# EasyEDA Pro project OURs_PHONE_EPRO_FILE_2025-04-21.epro, board 1-PCB_PCB_OURS PHONE_CONNECTORS_FLIP
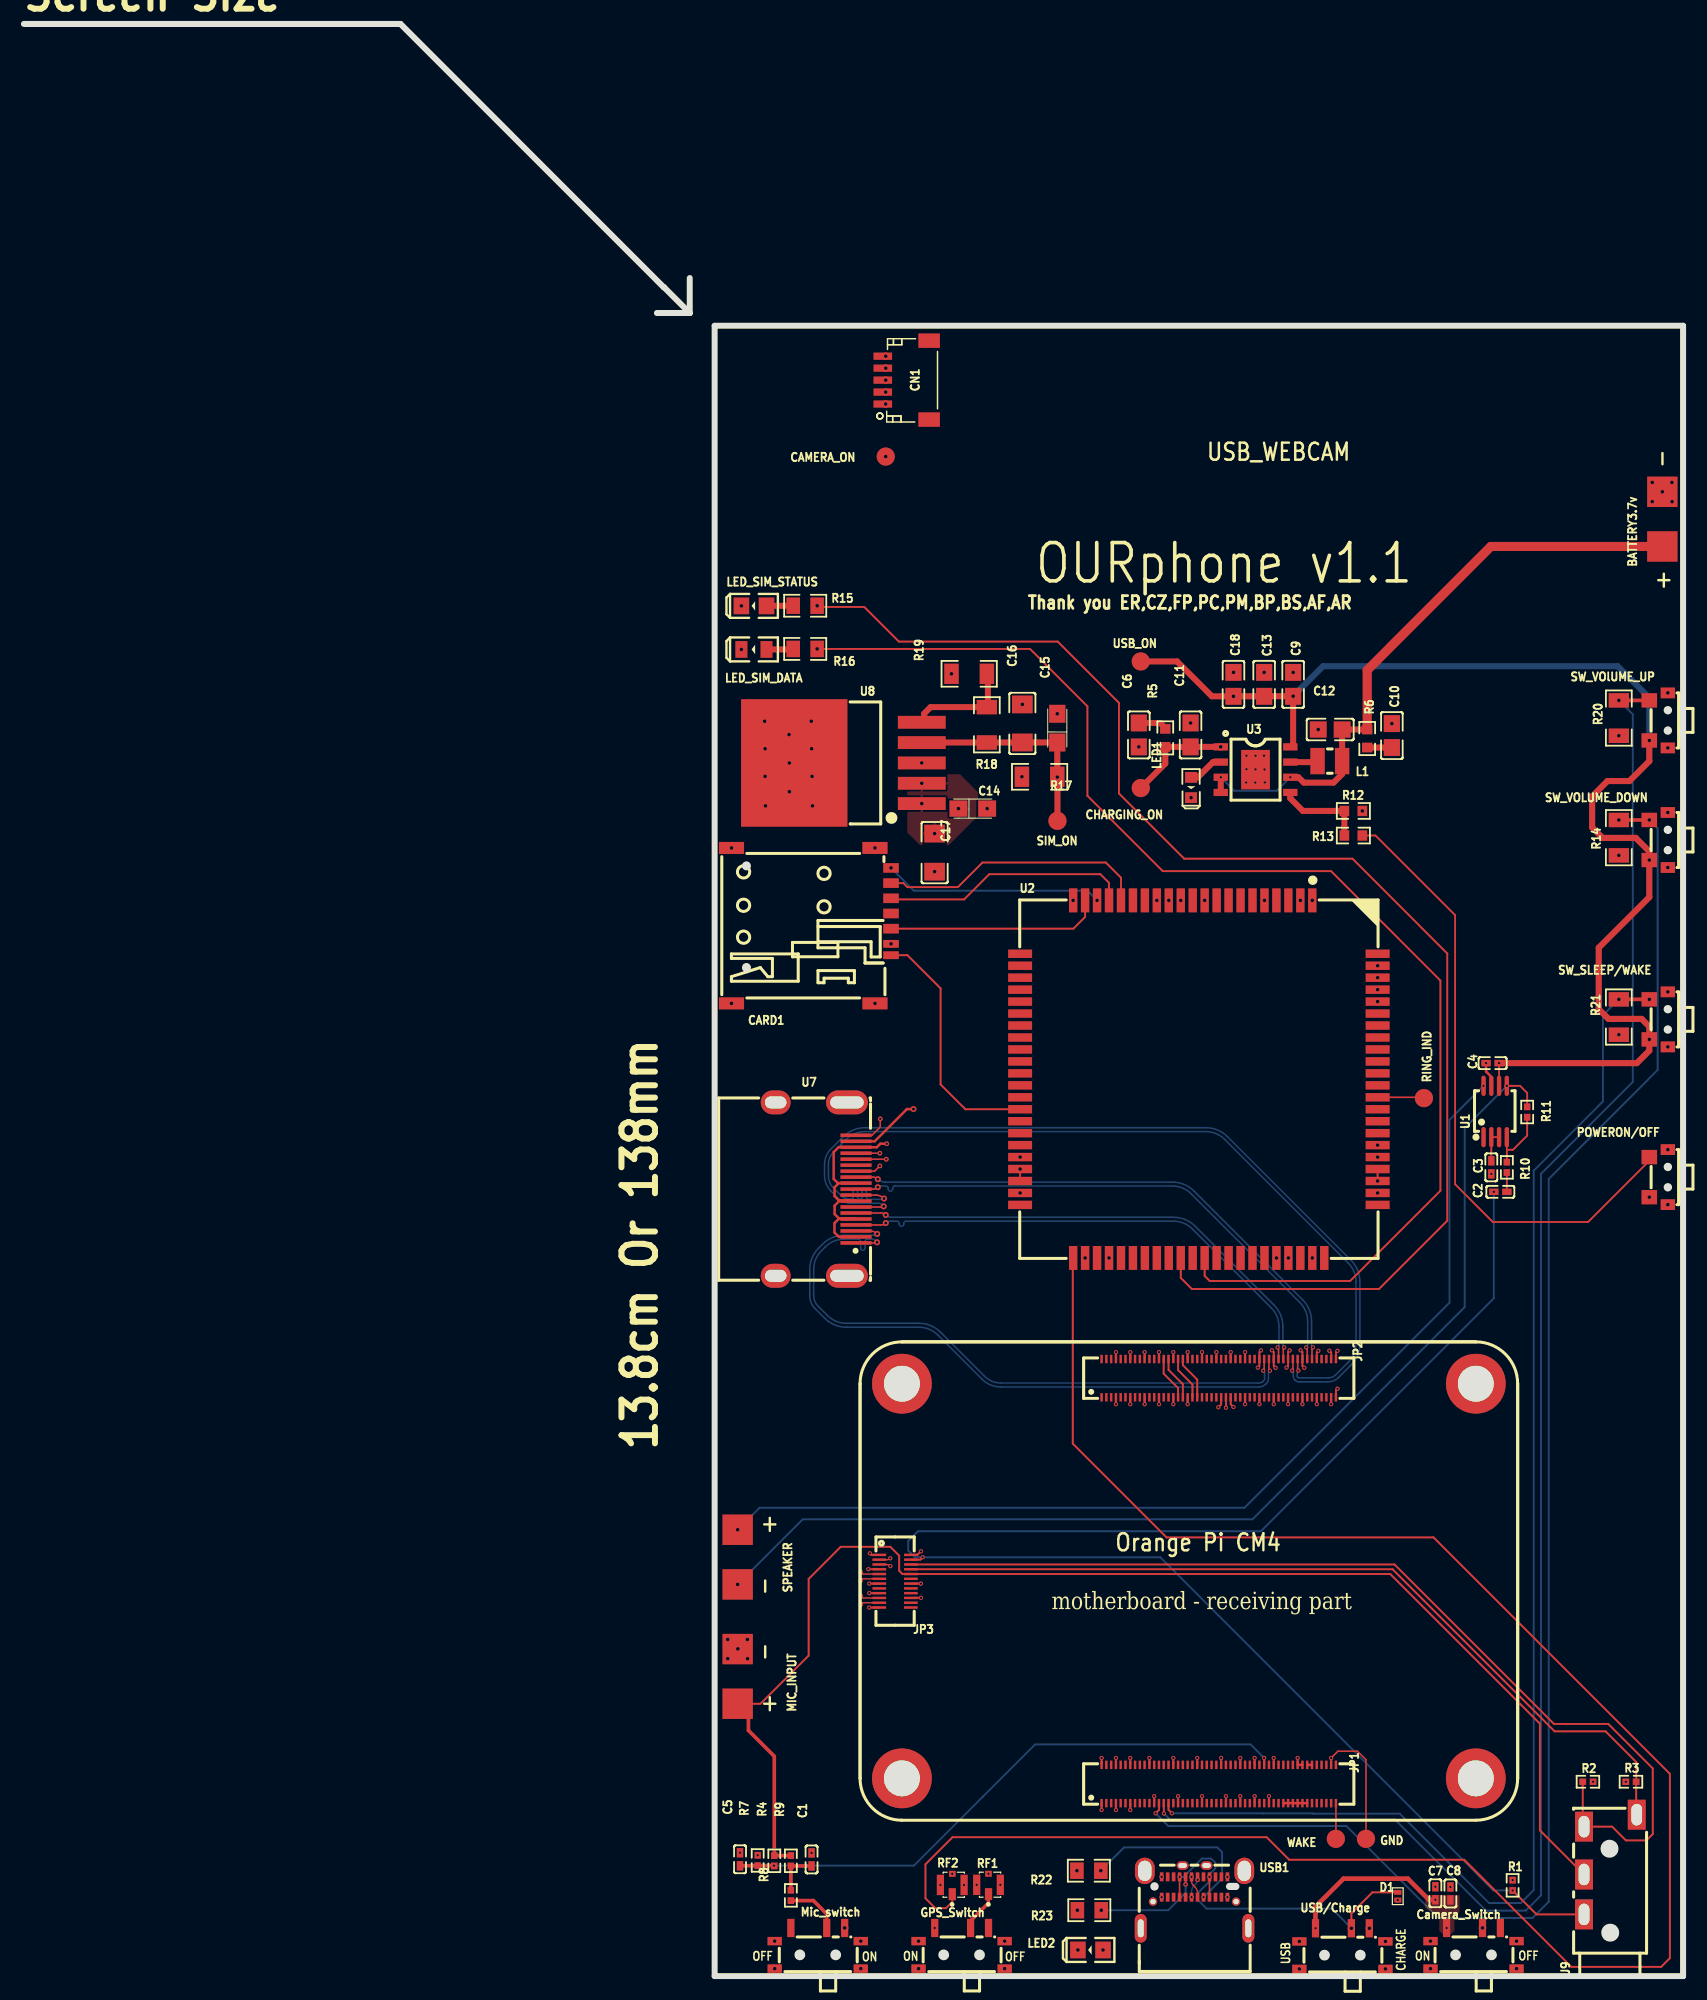
[diagram p10: board, top side]
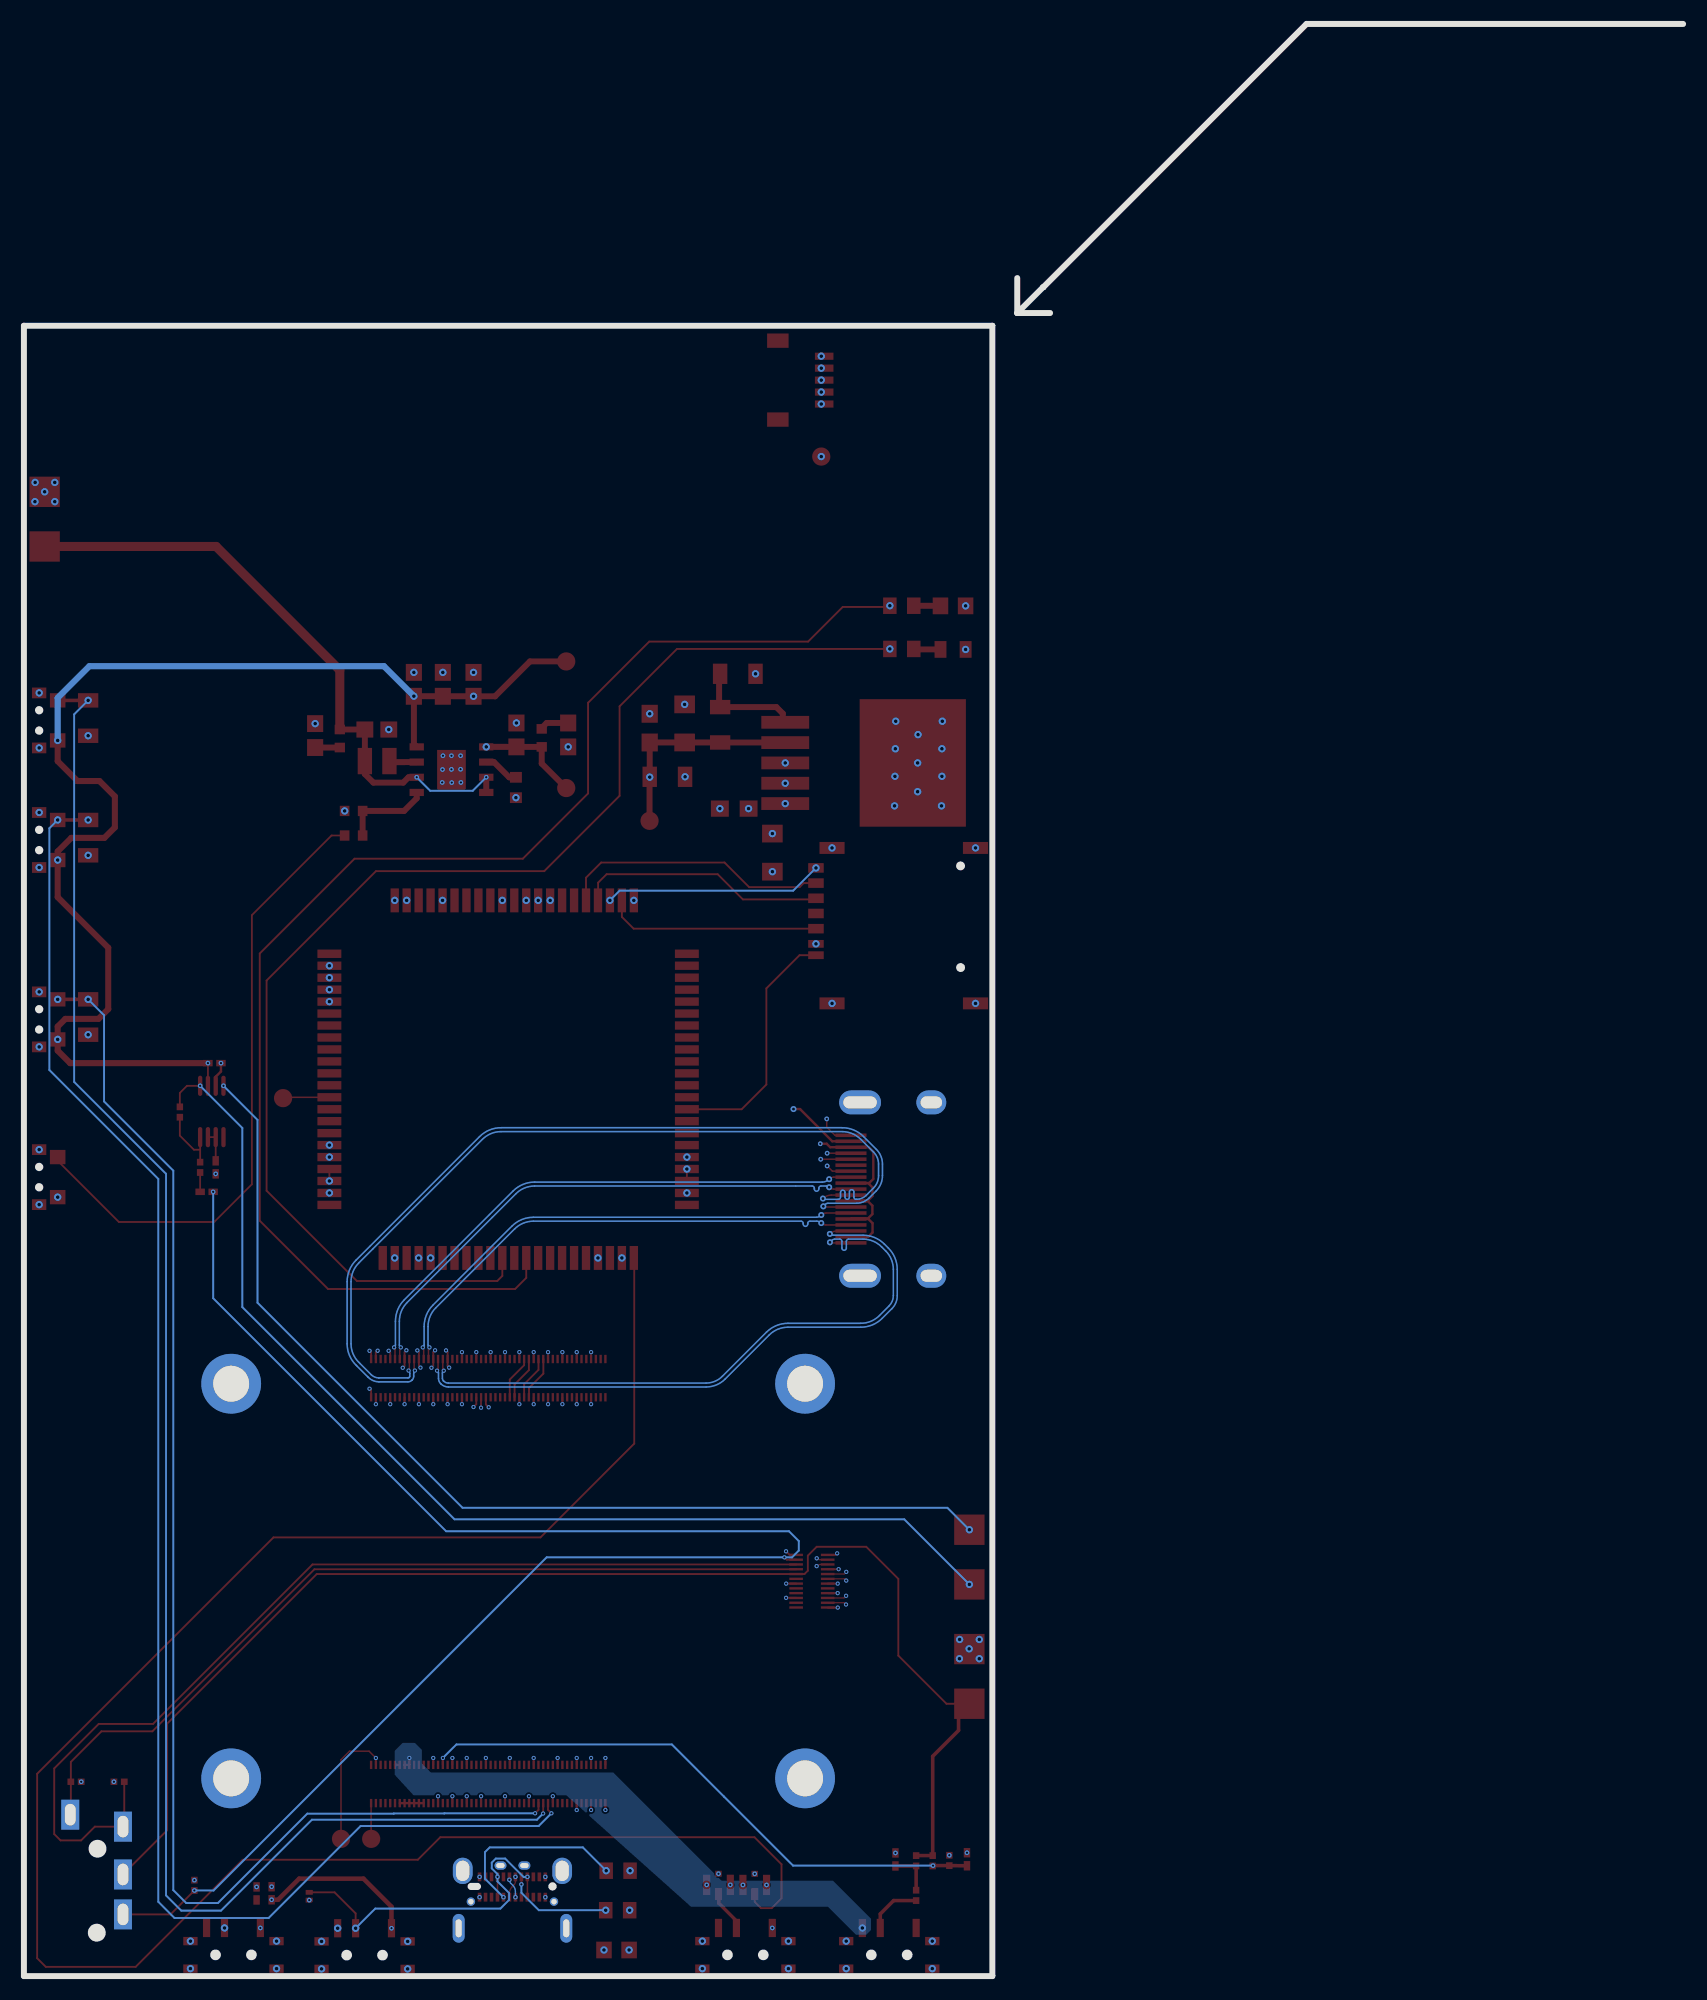
[diagram p11: board, bottom side, seen from below]

Outline 138.77 x 163.24 mm; copper layers: Top Layer, L2_INR1, L3_GND, Bottom Layer. Coordinates in mm from the lower left corner of the outline.
Outline path: 0,163.24 31.49,163.24 53.51,141.23 53.53,141.23 55.69,139.06 ; 55.69,139.06 52.95,139.06 ; 55.69,139.06 55.69,141.99 ; 57.77,138 57.77,0 138.77,0 138.77,138 57.77,138
Stack: Top Layer 0.035mm Outer layer thickness 1oz / Prepreg1 0.0994mm 3313 RC57% 4.2mil / L2_INR1 0.0152mm Inner layer thickness / Core 1.265mm 1.3mm H/HOZ with Copper / L3_GND 0.0152mm Inner layer thickness / Prepreg2 0.0994mm 3313 RC57% 4.2mil / Bottom Layer 0.035mm Outer layer thickness 1oz

## Design rules (mm)
net HDMI_TX2_P: DP4
net HDMI_TX2_N: DP4
net HDMI_TX1_P: DP3
net HDMI_TX1_N: DP3
net HDMI_TX0_P: DP1
net HDMI_TX0_N: DP1
net HDMI_TXCLK_P: DP2
net HDMI_TXCLK_N: DP2
net USB2_HOST2_N: DP6
net USB2_HOST2_P: DP6
net USB3_HOST1_P: DP5
net USB3_HOST1_N: DP5
net USB2_HOST3_P: DP7
net USB2_HOST3_N: DP7
template: User Custom Config
spacing Default (default): track to track 0.076, other pairs 0 to 0.152
spacing DP_BOT: track to track 0.152, other pairs 0 to 0.203
spacing DP_INR1: track to track 0.246, other pairs 0.15 to 0.3
track width Default: min 0.076, default 0.157, max 0.762
track width DP_BOT (default): min 0.124, default 0.124, max 0.124
track width DP_INR1: min 0.107, default 0.107, max 0.107
differential pair DP_BOT (default): width min 0.124, default 0.124, max 0.124; gap min 0.203, default 0.203
differential pair DP_INR1: width min 0.107, default 0.107, max 0.107; gap min 0.203, default 0.203
via Default (default): diameter min 0.178, default 0.762, max 100.025; hole min 0.15, default 0.61, max 59.995
via DP1: diameter min 0.201, default 0.61, max 100.025; hole min 0.15, default 0.61, max 59.995
net HDMI_TX2_P uses DP1, DP_BOT
net HDMI_TX2_N uses DP1, DP_BOT
net HDMI_TX1_P uses DP1, DP_BOT
net HDMI_TX1_N uses DP1, DP_BOT
net HDMI_TX0_P uses DP1, DP_BOT
net HDMI_TX0_N uses DP1, DP_BOT
net HDMI_TXCLK_P uses DP1, DP_BOT
net HDMI_TXCLK_N uses DP1, DP_BOT
net +5V uses Default
net BATTERY+ uses Default
net NETLIGHT uses Default
net STATUS uses Default
net VIN uses Default
net SPEAKER- uses Default
net HPR_OUT uses Default
net HP_SNS uses Default
net VBAT uses Default
net HPL_OUT uses Default
net GND uses Default
net GPIO3_D5 uses Default
net GPIO3_D1 uses Default
net GPIO3_D2 uses Default
net MIC1_IN uses Default
net SARADC_VIN1 uses Default
net V_USB uses Default
net SPEAKER+ uses Default
net USIM_CLK uses Default
net USIM_DATA uses Default
net USIM_RST uses Default
net USIM_VDD uses Default
net CARD_DETECT uses Default
net VCC_3V3 uses Default
net HDMI_CEC_PORT uses Default
net HDMI_TXDDC_SCL_PORT uses Default
net HDMI_TXDDC_SDA_PORT uses Default
net HDMI_TX_HPD_PORT uses Default
net VBUS uses Default
net VCC_1V8 uses Default
net MIPI_CSI_RX_D2N uses Default
net MIPI_CSI_RX_D2P uses Default
net MIPI_CSI_RX_D3N uses Default
net MIPI_CSI_RX_D3P uses Default
net $2N12 uses Default
net $2N528 uses Default
net $2N7 uses Default
net $4N691 uses Default
net $4N692 uses Default
net $2N2 uses Default
net $3N2 uses Default
net $4N694 uses Default
net $4N15 uses Default
net $4N12 uses Default
net $4N693 uses Default
net $3N284 uses Default
net $3N283 uses Default
net $2N10 uses Default
net $4N20 uses Default
net $4N10 uses Default
net $4N24 uses Default
net $4N26 uses Default
net $3N1 uses Default
net $3N841 uses Default
net $2N1557 uses Default
net USB2_HOST2_N uses DP_INR1
net USB2_HOST2_P uses DP_INR1
net USB3_HOST1_P uses DP_INR1
net USB3_HOST1_N uses DP_INR1
net USB2_HOST3_P uses DP_INR1
net USB2_HOST3_N uses DP_INR1
diff pair DP6 uses DP_INR1
diff pair DP5 uses DP_INR1
diff pair DP7 uses DP_INR1
pour e150 uses +5V

## Placement (name value [footprint] x y rotation side)
BATTERY3.7v  NOB  [BATTERY SYMBOL]  138.18 125.39 90 top
C1  10uF  [C0402]  65.88 9.75 270 top
C2  390nF  [C0402]  123.49 65.58 0 top
C3  1uF  [C0402]  122.73 67.63 90 top
C4  1uF  [C0402]  122.84 76.34 0 top
C5  100nF  [C0402]  59.9 9.77 270 top
C6  10uF  [C0805]  93.25 103.79 90 top
C7  100nF  [C0402]  118.05 6.93 90 top
C8  10uF  [C0402]  119.31 6.91 270 top
C9  22uF  [C0805]  106.16 108.02 270 top
C10  10uF  [C0805]  114.41 103.73 270 top
C11  10uF  [C0805]  97.58 103.79 270 top
C12  10uF  [C0805]  109.26 104.24 0 top
C13  22uF  [C0805]  103.73 108.02 270 top
C14  100uF  [CASE-A_3216]  79.36 97.63 0 top
C15  330uF  [CASE-A_3216]  86.43 104.35 90 top
C16  0.1u  [C1206]  83.51 104.75 270 top
C17  1uF  [C1206]  76.17 93.94 90 top
C18  22uF  [C0805]  101.17 108.02 270 top
CAMERA_ON  TP-橘色测试点  [TESTPOINT-TH_BD3.2]  72.08 127.06 0 top
Camera_Switch  HX MSK12C02-HB  [SW-SMD_MSK12C02-HB]  121.25 2.32 0 top
CARD1  SMN-303  [SIM-SMD_SMN-303]  65.85 87.84 270 top
CHARGING_ON  TP-橘色测试点  [TESTPOINT-TH_BD3.2]  93.41 99.34 0 top
CN1  SM05B-SRSS-TB (LF)(SN)  [CONN-SMD_SM05B-SRSS-TB-LF-SN]  73.78 133.45 90 top
D1  AZ5825-01F  [DFN-2L_L1.0-W0.6-P0.65-BI]  114.91 6.68 90 top
GND  TP-橘色测试点  [TESTPOINT-TH_BD3.2]  112.25 11.48 0 top
GPS_Switch  HX MSK12C02-HB  [SW-SMD_MSK12C02-HB]  78.43 2.32 0 top
JP1  DF40C-100DS-0.4V(51)  [CONN-SMD_DF40C-100DS-0.4V-51]  99.94 16.06 180 top
JP2  DF40C-100DS-0.4V(51)  [CONN-SMD_DF40C-100DS-0.4V-51]  99.94 50 180 top
JP3  DF40C-24DS-0.4V(51)  [CONN-SMD_DF40C-24DS-0.4V51]  72.87 33.02 90 top
L1  1uH  [IND-SMD_L2.5-W2.0]  109.23 101.6 180 top
LED1  LED-0603_G  [LED0603_GREEN]  97.62 99.39 270 top
LED2  LED-0805_G  [LED0805_GREEN]  89.21 2.18 180 top
LED_SIM_DATA  LED-0805_R  [LED0805_RED]  61.06 110.93 180 top
LED_SIM_STATUS  LED-0805_B  [LED0805_BLUE]  61.06 114.58 180 top
MIC_INPUT  NOB  [BATTERY SYMBOL]  60.84 28.61 90 top
Mic_switch  HX MSK12C02-HB  [SW-SMD_MSK12C02-HB]  66.4 2.32 0 top
NOREF  -  [Pad_e1062]  121.44 16.53 0 top
NOREF#2  -  [Pad_e1063]  73.44 16.53 0 top
NOREF#3  -  [Pad_e1061]  121.44 49.53 0 top
NOREF#4  -  [Pad_e1064]  73.44 49.53 0 top
POWERON/OFF  TS24CA  [SW-SMD_TS24CA]  136.72 66.81 270 top
R1  470Ω  [R0402]  124.51 7.59 270 top
R2  470Ω  [R0402]  130.81 16.25 180 top
R3  0Ω  [R0402]  134.41 16.25 0 top
R4  100kΩ  [R0402]  62.76 9.64 270 top
R5  2R  [R0603]  95.46 103.54 90 top
R6  2R  [R0603]  112.35 103.49 90 top
R7  100kΩ  [R0402]  61.37 9.67 270 top
R8  22Ω  [R0402]  64.15 6.75 270 top
R9  2.2kΩ  [R0402]  64.15 9.64 270 top
R10  20kΩ  [R0402]  124.03 67.63 90 top
R11  20kΩ  [R0402]  125.73 72.25 270 top
R12  20R  [R0603]  111.19 97.43 0 top
R13  10K  [R0603]  111.19 95.37 0 top
R14  10K  [R1206]  133.4 95.2 90 top
R15  65R  [R0805]  65.35 114.59 180 top
R16  65R  [R0805]  65.35 110.98 180 top
R17  470  [R1206]  84.95 100.29 180 top
R18  100K  [R1206]  80.54 104.63 90 top
R19  47K  [R1206]  79.06 108.9 180 top
R20  10K  [R1206]  133.4 105.2 90 top
R21  10K  [R1206]  133.4 80.2 90 top
R22  5.1K  [R0805]  89.07 8.81 0 top
R23  5.1K  [R0805]  89.11 5.51 0 top
RF1  IPEX-4  [IPEX-SMD_4P-L1.8-W1.7-LS2.0]  80.68 7.71 0 top
RF2  IPEX-4  [IPEX-SMD_4P-L1.8-W1.7-LS2.0]  77.65 7.7 0 top
RING_IND  TP-橘色测试点  [TESTPOINT-TH_BD3.2]  117.1 73.42 0 top
SIM_ON  TP-橘色测试点  [TESTPOINT-TH_BD3.2]  86.44 96.6 0 top
SPEAKER  NOB  [BATTERY SYMBOL]  58.55 31.48 270 top
SW_SLEEP/WAKE  TS24CA  [SW-SMD_TS24CA]  136.72 80 270 top
SW_VOLUME_DOWN  TS24CA  [SW-SMD_TS24CA]  136.72 95 270 top
SW_VOlUME_UP  TS24CA  [SW-SMD_TS24CA]  136.72 105 270 top
U1  LM4990MM/NOPB  [MSOP-8_L3.0-W3.0-P0.65-LS5.0-BL]  123.06 72.3 0 top
U2  SIM7600E  [COMM-SMD_L30.0-W30.0_SIM7600E]  98.27 75 270 top
U3  IP5306  [ESOP-8_L4.9-W3.9-P1.27-LS6.0-BL-EP]  103.01 100.88 270 top
U7  HDMI-216  [HDMI-SMD_KH-HDMI-19P-CU]  66.24 65.81 270 top
U8  MIC29302WU  [TO-263-5_L10.2-W9.9-P1.70-LS14.4-TL]  69.76 101.44 180 top
U9  PJ-3200B-4A  [AUDIO-TH_PJ-3200B-4A]  132.69 9.33 90 top
USB1  UT12113-11601-7H  [USB-C-SMD_UT12113-11601-7H]  97.91 6.62 0 top
USB/Charge  HX MSK12C02-HB  [SW-SMD_MSK12C02-HB]  110.28 2.3 0 top
USB_ON  TP-橘色测试点  [TESTPOINT-TH_BD3.2]  93.41 109.93 0 top
WAKE  TP-橘色测试点  [TESTPOINT-TH_BD3.2]  109.73 11.48 0 top

## Footprints (pads in the part's own frame, mm; a bottom-side part is the same pattern mirrored in y, then rotated)
AUDIO-TH_PJ-3200B-4A
  rect 2.5x1.5 hole 1.8x0.9: 1(4.17,-2.204) 2(3.17,2.204) 3(-4.17,2.204) 4(-0.831,2.204)
BATTERY SYMBOL
  rect 2.54x2.54 smd: 1(-5.842,1.143) 2(-1.27,1.143)
C0402
  rect 0.79x0.54 smd: 1(-0.545,0) 2(0.545,0)
C0805
  rect 1.41x1.35 smd: 1(-1,0) 2(1,0)
C1206
  rect 1.485x1.728 smd: 1(-1.593,0) 2(1.593,0)
CASE-A_3216
  rect 1.5x1.359 smd: 1(-1.2,0) 2(1.2,0)
COMM-SMD_L30.0-W30.0_SIM7600E
  rect 2x0.7 smd: 1(-14.95,9.486) 2(-14.95,8.486) 3(-14.95,7.486) 4(-14.95,6.486) 5(-14.95,5.486) 6(-14.95,4.486) 7(-14.95,3.486) 8(-14.95,2.486) 9(-14.95,1.486) 10(-14.95,0.486) 11(-14.95,-0.514) 12(-14.95,-1.514) 13(-14.95,-2.514) 14(-14.95,-3.514) 15(-14.95,-4.514) 16(-14.95,-5.514) 17(-14.95,-6.514) 18(-14.95,-7.514) 19(-14.95,-8.514) 20(-14.95,-9.514) 41(14.95,-9.514) 42(14.95,-8.514) 43(14.95,-7.514) 44(14.95,-6.514) 45(14.95,-5.514) 46(14.95,-4.514) 47(14.95,-3.514) 48(14.95,-2.514) 49(14.95,-1.514) 50(14.95,-0.514) 51(14.95,0.486) 52(14.95,1.486) 53(14.95,2.486) 54(14.95,3.486) 55(14.95,4.486) 56(14.95,5.486) 57(14.95,6.486) 58(14.95,7.486) 59(14.95,8.486) 60(14.95,9.486) 81(-14.95,-10.514) 82(14.95,-10.514) 85(14.95,10.486)
  rect 0.7x2 smd: 21(-9.486,-14.95) 22(-8.486,-14.95) 23(-7.486,-14.95) 24(-6.486,-14.95) 25(-5.486,-14.95) 26(-4.486,-14.95) 27(-3.486,-14.95) 28(-2.486,-14.95) 29(-1.486,-14.95) 30(-0.486,-14.95) 31(0.514,-14.95) 32(1.514,-14.95) 33(2.514,-14.95) 34(3.514,-14.95) 35(4.514,-14.95) 36(5.514,-14.95) 37(6.514,-14.95) 38(7.514,-14.95) 39(8.514,-14.95) 40(9.514,-14.95) 61(9.514,14.95) 62(8.514,14.95) 63(7.514,14.95) 64(6.514,14.95) 65(5.514,14.95) 66(4.514,14.95) 67(3.514,14.95) 68(2.514,14.95) 69(1.514,14.95) 70(0.514,14.95) 71(-0.486,14.95) 72(-1.486,14.95) 73(-2.486,14.95) 74(-3.486,14.95) 75(-4.486,14.95) 76(-5.486,14.95) 77(-6.486,14.95) 78(-7.486,14.95) 79(-8.486,14.95) 80(-9.486,14.95) 83(10.514,-14.95) 84(-10.486,-14.95) 86(-10.486,14.95) 87(10.514,14.95)
CONN-SMD_DF40C-24DS-0.4V51
  rect 0.2x1.14 smd: 1(2.2,1.32) 2(2.2,-1.32) 3(1.8,1.32) 4(1.8,-1.32) 5(1.4,1.32) 6(1.4,-1.32) 7(1,1.32) 8(1,-1.32) 9(0.6,1.32) 10(0.6,-1.32) 11(0.2,1.32) 12(0.2,-1.32) 13(-0.2,1.32) 14(-0.2,-1.32) 15(-0.6,1.32) 16(-0.6,-1.32) 17(-1,1.32) 18(-1,-1.32) 19(-1.4,1.32) 20(-1.4,-1.32) 21(-1.8,1.32) 22(-1.8,-1.32) 23(-2.2,1.32) 24(-2.2,-1.32)
CONN-SMD_DF40C-100DS-0.4V-51
  rect 0.2x0.7 smd: 1(9.8,1.6) 2(9.8,-1.6) 3(9.4,1.6) 4(9.4,-1.6) 5(9,1.6) 6(9,-1.6) 7(8.6,1.6) 8(8.6,-1.6) 9(8.2,1.6) 10(8.2,-1.6) 11(7.8,1.6) 12(7.8,-1.6) 13(7.4,1.6) 14(7.4,-1.6) 15(7,1.6) 16(7,-1.6) 17(6.6,1.6) 18(6.6,-1.6) 19(6.2,1.6) 20(6.2,-1.6) 21(5.8,1.6) 22(5.8,-1.6) 23(5.4,1.6) 24(5.4,-1.6) 25(5,1.6) 26(5,-1.6) 27(4.6,1.6) 28(4.6,-1.6) 29(4.2,1.6) 30(4.2,-1.6) 31(3.8,1.6) 32(3.8,-1.6) 33(3.4,1.6) 34(3.4,-1.6) 35(3,1.6) 36(3,-1.6) 37(2.6,1.6) 38(2.6,-1.6) 39(2.2,1.6) 40(2.2,-1.6) 41(1.8,1.6) 42(1.8,-1.6) 43(1.4,1.6) 44(1.4,-1.6) 45(1,1.6) 46(1,-1.6) 47(0.6,1.6) 48(0.6,-1.6) 49(0.2,1.6) 50(0.2,-1.6) 51(-0.2,1.6) 52(-0.2,-1.6) 53(-0.6,1.6) 54(-0.6,-1.6) 55(-1,1.6) 56(-1,-1.6) 57(-1.4,1.6) 58(-1.4,-1.6) 59(-1.8,1.6) 60(-1.8,-1.6) 61(-2.2,1.6) 62(-2.2,-1.6) 63(-2.6,1.6) 64(-2.6,-1.6) 65(-3,1.6) 66(-3,-1.6) 67(-3.4,1.6) 68(-3.4,-1.6) 69(-3.8,1.6) 70(-3.8,-1.6) 71(-4.2,1.6) 72(-4.2,-1.6) 73(-4.6,1.6) 74(-4.6,-1.6) 75(-5,1.6) 76(-5,-1.6) 77(-5.4,1.6) 78(-5.4,-1.6) 79(-5.8,1.6) 80(-5.8,-1.6) 81(-6.2,1.6) 82(-6.2,-1.6) 83(-6.6,1.6) 84(-6.6,-1.6) 85(-7,1.6) 86(-7,-1.6) 87(-7.4,1.6) 88(-7.4,-1.6) 89(-7.8,1.6) 90(-7.8,-1.6) 91(-8.2,1.6) 92(-8.2,-1.6) 93(-8.6,1.6) 94(-8.6,-1.6) 95(-9,1.6) 96(-9,-1.6) 97(-9.4,1.6) 98(-9.4,-1.6) 99(-9.8,1.6) 100(-9.8,-1.6)
CONN-SMD_SM05B-SRSS-TB-LF-SN
  rect 0.6x1.55 smd: 1(-2,1.938) 2(-0.999,1.938) 3(0.001,1.938) 4(1,1.938) 5(2.001,1.938)
  rect 1.2x1.8 smd: 6(-3.3,-1.938) 7(3.3,-1.938)
DFN-2L_L1.0-W0.6-P0.65-BI
  custom 0.41x0.6 smd: 1(-0.325,0)
  rect 0.4x0.6 smd: 2(0.325,0)
ESOP-8_L4.9-W3.9-P1.27-LS6.0-BL-EP
  rect 0.6x1.2 smd: 1(-1.905,-2.909) 2(-0.635,-2.909) 3(0.635,-2.909) 4(1.905,-2.909) 5(1.905,2.909) 6(0.635,2.909) 7(-0.635,2.909) 8(-1.905,2.909)
  rect 3.3x2.4 smd: 9(0,0)
HDMI-SMD_KH-HDMI-19P-CU
  rect 0.3x2.6 smd: 1(4.5,3.36) 2(4,3.36) 3(3.501,3.36) 4(3,3.36) 5(2.501,3.36) 6(2.001,3.36) 7(1.5,3.36) 8(1,3.36) 9(0.5,3.36) 10(0.001,3.36) 11(-0.499,3.36) 12(-1,3.36) 13(-1.5,3.36) 14(-2,3.36) 15(-2.499,3.36) 16(-2.999,3.36) 17(-3.499,3.36) 18(-3.999,3.36) 19(-4.5,3.36)
  oval 2x3.5 hole 1x2.8: 20(-7.25,2.6) 21(7.25,2.6)
  oval 2x2.5 hole 1x1.8: 22(-7.25,-3.36) 23(7.25,-3.36)
IND-SMD_L2.5-W2.0
  rect 1.2x2.2 smd: 1(1.028,0) 2(-1.028,0)
IPEX-SMD_4P-L1.8-W1.7-LS2.0
  rect 0.6x1 smd: 1(0.001,-0.852)
  rect 0.6x1.7 smd: 2(0.99,-0.077) 4(-0.99,-0.077)
  rect 0.55x0.5 smd: 3(0.001,0.852)
LED0603_GREEN
  rect 0.9x1 smd: 1(-0.85,0) 2(0.85,0)
LED0805_BLUE
  rect 1.3x1.399 smd: 1(-1.05,0) 2(1.05,0)
LED0805_GREEN
  rect 1.3x1.399 smd: 1(-1.05,0) 2(1.05,0)
LED0805_RED
  rect 1x1.399 smd: 1(-1.05,0) 2(1.05,0)
MSOP-8_L3.0-W3.0-P0.65-LS5.0-BL
  oval 0.364x1.692 smd: 1(-0.975,-2.146) 2(-0.325,-2.146) 3(0.325,-2.146) 4(0.975,-2.146) 5(0.975,2.146) 6(0.325,2.146) 7(-0.325,2.146) 8(-0.975,2.146)
Pad_e1061
  round 5 hole 3: 101(0,0)
Pad_e1062
  round 5 hole 3: 101(0,0)
Pad_e1063
  round 5 hole 3: 101(0,0)
Pad_e1064
  round 5 hole 3: 101(0,0)
R0402
  rect 0.566x0.54 smd: 1(-0.433,0) 2(0.433,0)
R0603
  rect 0.806x0.864 smd: 1(-0.753,0) 2(0.753,0)
R0805
  rect 1.133x1.377 smd: 1(-1,0) 2(1,0)
R1206
  rect 1.208x1.701 smd: 1(-1.479,0) 2(1.479,0)
SIM-SMD_SMN-303
  rect 1x2.1 smd: 8(-6.5,5.328) 9(6.5,5.328) 10(6.5,-6.672) 11(-6.5,-6.672)
  rect 0.8x1.3 smd: C1(0.25,6.672) C2(-2.29,6.672) C3(-4.83,6.672) C6(-1.02,6.672) C7(-3.56,6.672)
  rect 0.65x1.3 smd: C5(1.52,6.672) CD(2.47,6.672)
SW-SMD_MSK12C02-HB
  rect 0.6x1.524 smd: 1(-2.25,1.7) 2(0.75,1.7) 3(2.25,1.7)
  rect 1.2x0.7 smd: 4(-3.6,0.6) 4(-3.6,-1.7) 4(3.6,0.6) 4(3.6,-1.7)
SW-SMD_TS24CA
  rect 0.9x1.2 smd: 1(-2.3,0.775) 2(2.3,0.775)
  rect 1.2x1.3 smd: 3(-1.675,-0.775) 4(1.675,-0.775)
TESTPOINT-TH_BD3.2
  round 1.524 smd: 1(0,0)
TO-263-5_L10.2-W9.9-P1.70-LS14.4-TL
  rect 4x1.069 smd: 1(-5.334,3.4) 2(-5.334,1.7) 3(-5.334,0) 4(-5.334,-1.7) 5(-5.334,-3.4)
  rect 8.89x10.66 smd: 6(5.334,0)
USB-C-SMD_UT12113-11601-7H
  round 0.7 hole 0.45: 1(-3.474,-0.395) 1(3.475,-0.395)
  oval 1x2.4 hole 0.5x1.5: 2(-4.5,-2.625) 2(4.5,-2.625)
  oval 1x0.7 hole 0.7x0.4: 2(-1,2.625) 2(1,2.625)
  oval 1.65x2.2 hole 1.1x1.7: 13(-4.16,2.176) 13(4.16,2.176)
  rect 0.3x0.74 smd: A1(-2.75,1.675) A2(-2.249,1.675) A3(-1.75,1.675) A4(-1.25,1.675) A5(-0.75,1.675) A6(-0.249,1.675) A7(0.25,1.675) A8(0.75,1.675) A9(1.25,1.675) A10(1.75,1.675) A11(2.25,1.675) A12(2.751,1.675) B1(2.751,-0.025) B2(2.251,-0.025) B3(1.75,-0.025) B4(1.25,-0.025) B5(0.75,-0.025) B6(0.251,-0.025) B7(-0.249,-0.025) B8(-0.75,-0.025) B9(-1.25,-0.025) B10(-1.75,-0.025) B11(-2.249,-0.025) B12(-2.749,-0.025)

## Nets
As in the schematic, except:
GND: BATTERY3.7v.2 C1.1 C3.1 C4.1 C5.1 C6.1 C7.2 C8.1 C9.1 C10.1 C11.1 C12.1 C13.1 C14.2 C15.2 C16.1 C17.1 C18.1 Camera_Switch.4 CARD1.8 CARD1.9 CARD1.10 CARD1.11 CARD1.C5 CN1.4 CN1.5 D1.1 GND.1 GPS_Switch.4 JP1.1 JP1.2 JP1.7 JP1.8 JP1.13 JP1.14 JP1.22 JP1.23 JP1.32 JP1.33 JP1.42 JP1.43 JP1.52 JP1.53 JP1.59 JP1.60 JP1.65 JP1.66 JP1.71 JP1.74 JP1.98 JP2.7 JP2.8 JP2.13 JP2.14 JP2.19 JP2.20 JP2.25 JP2.26 JP2.31 JP2.32 JP2.37 JP2.38 JP2.44 JP2.50 JP2.55 JP2.56 JP2.61 JP2.62 JP2.67 JP2.68 JP2.73 JP2.74 JP2.79 JP2.80 JP2.85 JP2.86 JP2.91 JP2.92 JP2.97 JP2.98 JP3.1 JP3.2 JP3.7 JP3.13 JP3.14 JP3.17 JP3.20 JP3.23 LED1.2 LED2.2 LED_SIM_DATA.2 LED_SIM_STATUS.2 MIC_INPUT.2 Mic_switch.4 POWERON/OFF.1 POWERON/OFF.2 POWERON/OFF.4 R1.1 R2.1 R3.1 R7.1 R14.1 R17.2 R19.2 R20.1 R21.1 R22.1 R23.1 RF1.2 RF1.3 RF1.4 RF2.2 RF2.3 RF2.4 SW_SLEEP/WAKE.1 SW_SLEEP/WAKE.2 SW_VOLUME_DOWN.1 SW_VOLUME_DOWN.2 SW_VOlUME_UP.1 SW_VOlUME_UP.2 U1.7 U2.1 U2.2 U2.5 U2.10 U2.14 U2.37 U2.40 U2.41 U2.43 U2.57 U2.58 U2.60 U2.61 U2.64 U2.65 U2.77 U2.78 U2.80 U2.81 U3.9 U7.2 U7.5 U7.8 U7.11 U7.17 U7.20 U7.21 U7.22 U7.23 U8.3 U8.6 USB1.1 USB1.2 USB1.A1 USB1.A12 USB1.B1 USB1.B12 USB/Charge.4
BATTERY+: BATTERY3.7v.1 C12.2 L1.2 R6.2 U3.3 U3.4 U3.6
$4N24: R22.2 USB1.B5
$4N692: C10.2 R6.1

Pads without a net: Camera_Switch 3; CARD1 C6; CN1 6 7; GPS_Switch 3; JP1 3 4 5 6 9 10 11 12 15 16 17 18 19 20 21 24 26 28 30 31 34 35 36 37 38 39 40 41 44 45 46 47 48 49 50 51 54 55 56 57 58 61 62 63 64 67 68 69 72 73 75 76 78 80 82 89 91 92 93 94 95 96 97 100; JP2 1 2 3 4 5 6 9 10 11 12 15 16 17 18 21 22 23 24 27 29 40 42 43 45 46 47 48 49 52 54 57 58 59 60 63 64 65 66 69 71 75 77 81 83 87 89 93 94 95 96; JP3 12 15 16 18 22 24; Mic_switch 1; NOREF 101; NOREF#2 101; NOREF#3 101; NOREF#4 101; U1 1; U2 3 4 6 7 8 9 11 15 16 21 22 23 24 25 26 27 28 29 30 31 32 34 35 36 42 44 45 46 47 48 50 52 53 54 55 56 59 66 67 68 70 71 72 73 74 75 76 83 84 85 86 87; U7 14; USB1 13 A2 A3 A8 A10 A11 B2 B3 B8 B10 B11

## Via types
v1: diameter 0.503, hole 0.249, Top Layer to Bottom Layer, 9 vias
v2: diameter 0.353, hole 0.201, Top Layer to Bottom Layer, 87 vias
v3: diameter 0.4, hole 0.2, Top Layer to Bottom Layer, 43 vias
v4: diameter 0.62, hole 0.31, Top Layer to Bottom Layer, 134 vias
v5: diameter 0.381, hole 0.201, Top Layer to Bottom Layer, 11 vias

## Routing (per net, layer and track width the routed paths; a pad name or vN(x,y) marks a point on that pad's centre or on a via; arc(x,y) is an arc through that point)
+5V: length 202.2
  Top Layer w0.15: U1.6 v3(123.38,76.34)
  Top Layer w0.203: 69.6,69.81 71.16,69.81 73.85,72.5 v1(74.4,72.5)
  Top Layer w0.381: v3(108.03,4) 108.03,5.8 110.37,8.15 115.75,8.15 117.52,6.38 v3(118.05,6.38)
  Top Layer w0.5: USB_ON.1 96.45,109.93 99.36,107.02 v4(101.17,107.02) v4(106.16,107.03) 106.16,103.02 U3.8
  Top Layer w0.508: v3(123.38,76.34) 134.9,76.34 135.95,77.39 v4(135.95,78.32) 135.95,79.4 135.31,80.04 132.54,80.04 131.72,80.86 131.72,85.99 135.95,90.22 v4(135.95,93.32) 135.95,94.04 134.81,95.18 132.04,95.18 131.17,96.05 131.17,98.65 132.45,99.93 134.29,99.93 135.95,101.59 v4(135.95,103.32)
  L2_INR1 w0.508: v3(123.38,76.34) 124.62,76.34 125.42,75.54 125.42,28.19 116.43,19.2 116.43,7.25 117.3,6.38 v3(118.05,6.38)
  Bottom Layer w0.508: v4(106.16,107.03) 108.66,109.53 133.3,109.53 135.95,106.88 v4(135.95,103.32)
  vias: v3(119,4.02) v4(75.1,99.74) v4(75.1,98.04) v4(76.17,95.54) v4(78.16,97.62)
GND: length 74.5
  Top Layer w0.124: v2(109.34,18.24) 109.9,18.81 111.54,18.81 112.25,18.09 GND.1
  Top Layer w0.152: v2(105.87,52.32) 105.87,52.31 105.74,52.18 JP2.80 105.74,51.02 105.6,50.89 v2(105.6,50.88) ; 103.47,52.31 103.34,52.18 JP2.68 103.34,51.02 103.2,50.89 v2(103.2,50.88) ; v2(94.94,52.18) JP2.26 ; v2(102.14,52.18) JP2.62 ; v2(109.34,47.82) JP2.97 ; v2(93.74,52.18) JP2.20 ; v2(103.34,47.82) JP2.67 ; v2(104.38,52.33) 104.54,52.18 JP2.74 104.53,51.02 v2(104.69,50.87) ; v2(101.74,18.24) 101.74,17.66 ; v2(102.14,47.82) JP2.61 ; v2(108.14,47.82) JP2.91 ; v2(94.54,15.04) JP1.23 ; v2(105.74,47.82) JP2.79 ; v2(91.34,47.82) JP2.7 ; v2(91.34,18.24) 91.34,17.66 ; JP2.92 108.14,52.15 108.27,52.28 ; v2(98.14,18.24) 98.14,17.66 ; v2(102.94,15.04) JP1.65 ; v2(94.14,18.24) 94.14,17.66 ; v2(100.94,52.18) JP2.56 ; v2(92.54,18.24) 92.54,17.66 ; v2(104.54,18.24) 104.54,17.66 ; v2(106.78,52.33) 106.94,52.18 JP2.86 106.94,51.02 v2(107.09,50.87) ; v2(70.63,34.03) 70.64,34.02 JP3.7 ; JP2.98 109.34,51.61 109.34,52.13 v2(109.19,52.29) ; JP1.7 v2(91.34,13.89) ; JP2.55 100.94,47.82 v2(101.17,47.59) ; v2(104.14,15.04) JP1.71 ; v2(97.34,52.18) JP2.38 ; v2(90.14,18.24) 90.14,17.66 ; v2(92.54,47.82) JP2.13 ; v2(97.34,47.82) JP2.37 ; v2(100.54,15.04) JP1.53 ; JP1.13 v2(92.54,13.89) ; v2(96.14,52.18) JP2.32 ; v2(100.14,18.24) 100.14,17.66 ; v2(91.34,52.18) JP2.8 ; v2(96.14,47.82) JP2.31 ; v2(96.54,15.04) JP1.33 ; v2(99.74,52.18) JP2.50 ; v2(93.74,47.82) JP2.19 ; v2(102.94,18.24) 102.94,17.66 ; v2(101.74,15.04) JP1.59 ; v2(96.14,18.24) 96.14,17.66 ; v2(109.34,18.24) 109.34,17.66 ; v2(106.94,47.82) JP2.85 ; v2(94.94,47.82) JP2.25 ; v2(104.54,47.82) JP2.73 ; JP1.1 v2(90.14,13.89) ; v2(98.54,15.04) JP1.43 ; v2(92.54,52.18) JP2.14 ; v2(98.54,52.18) JP2.44
  Top Layer w0.158: 74.18,32.82 v2(75.02,32.82) ; JP3.13 v2(70.71,32.82) ; 71.54,30.82 70.7,30.82 ; 74.2,35.22 74.73,35.22 v2(75.03,35.52) ; 74.19,31.63 75.02,31.63 ; 71.55,32.02 70.71,32.02 ; 71.55,35.22 70.88,35.22 v2(70.75,35.35)
  Top Layer w0.203: v3(122.29,76.34) 122.29,75.64 122.73,75.2 U1.7 ; 68.16,66.31 69.6,66.31 ; 68.16,66.31 67.8,65.95 67.8,65.22 68.17,64.85 69.55,64.85 69.6,64.81 68.19,64.81 67.81,64.42 67.81,63.72 68.17,63.35 69.55,63.35 69.6,63.31 68.14,63.31 67.79,62.96 67.79,62.18 68.17,61.81 69.6,61.81 ; 68.16,66.31 68.08,66.31 67.73,66.66 67.73,68.9 68.14,69.31 71.34,69.31 71.63,69.6 v3(72.16,69.6)
  vias: v2(70.71,32.02) v2(70.7,30.82) v2(75.02,31.63) v2(103.47,52.32) v2(108.27,52.29) v3(59.9,10.31) v3(61.37,10.1) v3(65.88,10.3) v3(76.66,7.62) v3(77.65,8.55) v3(78.64,7.62) v3(79.69,7.63) v3(80.68,8.56) v3(81.67,7.63) v3(102.25,102.05) v3(102.25,100.92) v3(102.23,99.81) v3(103.01,102.05) v3(103.01,100.9) v3(102.99,99.8) v3(103.72,102.05) v3(103.76,100.89) v3(103.79,99.81) v3(114.91,6.35) v3(118.05,7.47) v3(119.31,7.46) v3(122.73,67.08) v3(124.51,8.02) v3(131.25,16.25) v3(133.98,16.25) v4(58.87,28.15) v4(58.87,26.54) v4(59.18,94.34) v4(59.18,81.34) v4(59.71,27.36) v4(60.01,114.58) v4(60.01,110.93) v4(60.51,28.15) v4(60.53,26.54) v4(61.96,104.93) v4(61.99,102.63) v4(61.99,100.33) v4(62.03,97.85) v4(62.8,2.92) v4(62.8,0.62) v4(63.99,103.81) v4(64.02,101.44) v4(64.02,99.04) v4(65.85,104.93) v4(65.89,102.63) v4(65.92,100.33) v4(65.95,97.85) v4(70,2.92) v4(70,0.62) v4(71.18,94.34) v4(71.18,81.34) v4(72.08,135.46) v4(72.08,134.45) v4(72.53,86.32) v4(74.83,2.92) v4(74.83,0.62) v4(75.1,101.44) v4(76.17,92.35) v4(77.58,108.9) v4(80.56,97.62) v4(82.03,2.92) v4(82.03,0.62) v4(83.32,68.49) v4(83.32,65.49) v4(83.51,106.34) v4(83.47,100.29) v4(86.43,105.55) v4(87.76,89.95) v4(88.07,8.81) v4(88.11,5.51) v4(88.16,2.18) v4(88.76,60.05) v4(90.76,60.05) v4(93.25,102.79) v4(94.76,89.95) v4(97.58,104.79) v4(97.62,98.54) v4(98.76,89.95) v4(101.17,109.02) v4(103.73,109.02) v4(103.76,89.95) v4(104.76,60.05) v4(105.76,60.05) v4(106.16,109.02) v4(106.67,2.9) v4(106.68,0.6) v4(106.76,89.95) v4(107.76,89.95) v4(107.76,60.05) v4(108.26,104.24) v4(113.22,84.49) v4(113.22,82.49) v4(113.22,81.49) v4(113.22,69.49) v4(113.22,68.49) v4(113.22,65.49) v4(113.88,2.9) v4(113.88,0.6) v4(114.41,104.73) v4(117.65,2.92) v4(117.65,0.62) v4(124.84,2.92) v4(124.84,0.62) v4(133.4,103.72) v4(133.4,93.72) v4(133.4,78.72) v4(135.95,65.13) v4(136.19,124.9) v4(136.19,123.29) v4(137.04,124.12) v4(137.5,107.3) v4(137.5,102.7) v4(137.5,97.3) v4(137.5,92.7) v4(137.5,82.3) v4(137.5,77.7) v4(137.5,69.11) v4(137.5,64.51) v4(137.84,124.9) v4(137.85,123.29) v5(95.16,8.3) v5(95.16,6.6) v5(100.66,8.3) v5(100.66,6.6)
VBAT: length 19.7
  Top Layer w0.157: U2.39 v4(83.32,67.49) ; v4(113.22,66.49) U2.63
  Top Layer w0.5: 75.3,103.15 R18.1 C16.2 C15.1 v4(86.43,100.26) arc(86.44,100.24) 86.44,100.22 SIM_ON.1
VBUS: length 2
  Top Layer w0.203: JP1.87 JP1.85 JP1.83 JP1.81 JP1.79 JP1.77
VCC_1V8: length 0.4
  Top Layer w0.203: 107.74,17.66 107.34,17.66
VCC_3V3: length 1
  Top Layer w0.152: v2(106.54,18.24) 106.54,17.66
  Top Layer w0.203: 106.94,17.66 106.54,17.66
  vias: v4(68.65,4.02)
VIN: length 136.7
  Top Layer w0.5: CHARGING_ON.1 95.46,101.39 R5.1 C11.2 v4(100.1,102.79)
  L2_INR1 w0.508: v4(100.1,102.79) 100.97,103.65 105.35,103.65 106.75,102.25 114.38,102.25 126.73,89.9 126.73,12.56 119.17,5 113.52,5 v4(112.53,4)
BATTERY+: length 52.6
  Top Layer w0.5: R6.2 C12.2 110.26,101.6 110.26,100.51 109.54,99.8 107.05,99.8 106.6,100.25 v3(105.92,100.25) ; v3(100.1,100.25) 100.1,98.98
  Top Layer w0.762: BATTERY3.7v.1 122.7,119.54 112.35,109.2 R6.2
  Bottom Layer w0.157: v3(105.92,100.25) 104.79,99.11 101.24,99.11 v3(100.1,100.25)
CARD_DETECT: length 20.8
  Top Layer w0.157: U2.33 78.74,72.49 76.67,74.55 76.67,82.59 73.9,85.37 CARD1.CD
GPIO3_D1: length 135
  Top Layer w0.158: v2(94.65,13.61) 94.94,13.9 94.94,14.36
  Top Layer w0.3: v4(133.4,96.67) v4(135.95,96.67)
  Bottom Layer w0.158: v2(94.65,13.61) 95.72,12.55 110.61,12.55 118.3,4.86 126.18,4.86 127.53,6.22 127.53,66.66 136.65,75.77 136.65,95.98 v4(135.95,96.67)
GPIO3_D2: length 142.3
  Top Layer w0.158: v2(95.35,13.59) 95.34,13.6 95.34,14.36
  Top Layer w0.3: v4(133.4,106.67) 135.95,106.67
  Bottom Layer w0.158: v2(95.35,13.59) 95.87,13.08 114.68,13.08 122.29,5.47 125.61,5.47 126.89,6.75 126.89,67.09 134.57,74.77 134.57,105.51 v4(133.4,106.67)
GPIO3_D5: length 114.8
  Top Layer w0.158: v2(96.02,13.61) 95.73,13.9 95.73,14.5
  Top Layer w0.3: v4(133.4,81.67) v4(135.95,81.67)
  Bottom Layer w0.158: v4(133.4,81.67) 132.07,80.34 132.07,73.14 126.28,67.35 126.28,7.19 125.2,6.11 122.54,6.11 115.07,13.58 107.85,13.58 107.83,13.6 103.62,13.6 103.6,13.61 v2(96.02,13.61)
HDMI_CEC_PORT: length 44.4
  Top Layer w0.124: 69.6,67.31 71.15,67.31 v3(71.59,67.75)
  Top Layer w0.152: v2(99.9,47.56) 100.14,47.8 JP2.51
  L2_INR1 w0.137: v3(71.59,67.75) 71.81,67.75 73.59,65.96 73.59,59.91 86.94,46.56 99.29,46.56 99.9,47.17 v2(99.9,47.56)
HDMI_TX0_N: length 75.9
  Top Layer w0.124: JP2.84 106.53,50.78 arc(106.55,50.7) v2(106.6,50.63) ; 69.6,65.31 71.24,65.31 arc(71.62,65.23) v1(71.94,65.02)
  Bottom Layer w0.124: 110.67,51.23 109.73,50.29 arc(109.44,50.09) 109.09,50.02 arc(109.08,50.02) 109.07,50.02 106.65,50.02 arc(106.59,50.03) 106.54,50.06 106.54,50.07 arc(106.51,50.11) 106.5,50.16 106.5,50.39 arc(106.53,50.52) v2(106.6,50.63) ; 110.67,51.23 110.78,51.34 arc(111.25,52.04) 111.41,52.87 111.41,58.07 arc(111.24,58.91) 110.76,59.63 109.61,60.78 100.43,69.97 arc(99.71,70.45) 98.86,70.61 70.34,70.61 arc(69.49,70.45) 68.77,69.97 67.7,68.9 arc(67.4,68.44) 67.29,67.9 67.29,66.93 arc(67.4,66.36) 67.72,65.88 68.31,65.3 arc(68.69,65.04) 69.14,64.95 69.17,64.95 arc(69.3,65.01) 69.36,65.14 69.36,65.58 arc(69.54,65.76) 69.73,65.58 69.73,65.14 arc(69.91,64.95) 70.1,65.14 70.1,65.54 arc(70.29,65.72) 70.47,65.54 70.47,65.14 arc(70.53,65.01) 70.66,64.95 71.78,64.95 arc(71.87,64.97) v1(71.94,65.02)
HDMI_TX0_P: length 75.9
  Top Layer w0.124: 69.6,64.31 71.78,64.31 arc(71.85,64.32) v1(71.91,64.36) ; JP2.82 106.14,50.78 arc(106.12,50.7) v2(106.07,50.63)
  Bottom Layer w0.124: v1(71.91,64.36) 71.74,64.54 arc(71.64,64.6) 71.53,64.62 69.14,64.62 arc(68.57,64.74) 68.08,65.06 67.49,65.65 arc(67.1,66.24) 66.96,66.93 66.96,67.9 arc(67.1,68.56) 67.47,69.13 68.54,70.2 arc(69.37,70.75) 70.34,70.94 98.86,70.94 arc(99.84,70.75) 100.66,70.2 109.84,61.01 111,59.86 arc(111.55,59.04) 111.74,58.07 111.74,52.87 arc(111.55,51.92) 111.01,51.11 110.9,51 109.97,50.07 arc(109.97,50.06) 109.96,50.05 arc(109.56,49.79) 109.08,49.69 106.65,49.69 arc(106.47,49.73) 106.31,49.83 106.31,49.84 arc(106.21,49.99) 106.17,50.16 106.17,50.39 arc(106.15,50.52) v2(106.07,50.63)
HDMI_TX1_N: length 42.8
  Top Layer w0.124: 69.6,63.81 71.68,63.81 arc(71.9,63.77) v1(72.08,63.64) ; JP2.78 105.34,52.39 arc(105.35,52.49) v2(105.41,52.57)
  Bottom Layer w0.124: v1(72.08,63.64) 72.12,63.61 arc(72.29,63.49) 72.49,63.45 96.16,63.45 arc(97.14,63.26) 97.96,62.71 104.56,56.11 arc(105.11,55.29) 105.3,54.32 105.3,52.76 arc(105.31,52.69) 105.35,52.63 v2(105.41,52.57)
HDMI_TX1_P: length 42.8
  Top Layer w0.124: JP2.76 104.94,52.38 arc(104.91,52.48) v2(104.85,52.57) ; 69.6,62.81 71.7,62.81 arc(71.91,62.85) v1(72.08,62.97)
  Bottom Layer w0.124: v2(104.85,52.57) 104.92,52.64 arc(104.96,52.7) 104.97,52.76 104.97,54.32 arc(104.8,55.16) 104.32,55.88 97.73,62.48 arc(97.01,62.96) 96.16,63.12 73.78,63.12 arc(73.64,63.07) 73.59,62.94 73.59,62.88 arc(73.4,62.69) 73.22,62.88 73.22,62.94 arc(73.16,63.07) 73.03,63.12 72.46,63.12 arc(72.26,63.08) v1(72.08,62.97)
HDMI_TX2_N: length 54.9
  Top Layer w0.124: 69.6,62.31 70.77,62.31 arc(71.09,62.24) v1(71.37,62.06) ; JP2.72 104.13,50.82 arc(104.16,50.71) v2(104.22,50.62)
  Bottom Layer w0.124: v2(104.22,50.62) 104.15,50.56 arc(104.11,50.5) 104.1,50.43 104.1,49.98 arc(104.05,49.74) 103.92,49.54 103.9,49.52 arc(103.61,49.33) 103.27,49.26 81.72,49.26 arc(80.86,49.43) 80.12,49.92 76.43,53.61 arc(75.72,54.09) 74.87,54.26 68.78,54.26 arc(67.81,54.45) 66.98,55 66.18,55.81 arc(65.84,56.31) 65.73,56.9 65.73,59.08 arc(65.92,60.05) 66.47,60.88 66.8,61.21 arc(67.63,61.76) 68.6,61.95 71.1,61.95 arc(71.24,61.98) v1(71.37,62.06)
HDMI_TX2_P: length 54.9
  Top Layer w0.124: JP2.70 103.74,50.81 arc(103.72,50.71) v2(103.66,50.62) ; 69.6,61.31 71.24,61.31 arc(71.31,61.32) v1(71.36,61.36)
  Bottom Layer w0.124: v2(103.66,50.62) 103.72,50.57 arc(103.76,50.51) 103.77,50.43 103.77,49.98 arc(103.75,49.87) 103.69,49.77 103.66,49.75 arc(103.48,49.63) 103.27,49.59 81.72,49.59 arc(80.98,49.74) 80.35,50.16 76.67,53.84 arc(75.84,54.39) 74.87,54.59 68.78,54.59 arc(67.93,54.75) 67.22,55.23 66.41,56.04 arc(66.15,56.43) 66.05,56.9 66.05,59.08 arc(66.22,59.93) 66.7,60.65 67.03,60.98 arc(67.75,61.46) 68.6,61.62 69.8,61.62 arc(69.93,61.57) 69.98,61.44 69.98,60.88 arc(70.17,60.69) 70.36,60.88 70.36,61.44 arc(70.41,61.57) 70.54,61.62 70.96,61.62 arc(71.08,61.6) 71.19,61.53 v1(71.36,61.36)
HDMI_TX_HPD_PORT: length 73.1
  Top Layer w0.124: v3(71.63,71.68) 71.63,71 70.93,70.31 69.6,70.31
  Top Layer w0.152: JP2.53 100.54,48.39 v2(100.54,47.53)
  L2_INR1 w0.137: v2(100.54,47.53) 100.54,47.12 101.07,46.59 110.15,46.59 111.63,48.07 111.63,53.45 109.12,55.96 80.83,55.96 75.91,60.88 75.91,67.68 71.91,71.68 v3(71.63,71.68)
HDMI_TXCLK_N: length 46.6
  Top Layer w0.124: 69.6,66.81 71.03,66.81 arc(71.23,66.77) 71.4,66.66 v1(71.42,66.63) ; JP2.90 107.73,52.39 arc(107.75,52.49) v2(107.81,52.57)
  Bottom Layer w0.124: v2(107.81,52.57) 107.75,52.63 arc(107.71,52.69) 107.7,52.76 107.7,54.76 arc(107.51,55.73) 106.95,56.55 99.83,63.68 97.86,65.65 arc(97.03,66.2) 96.06,66.39 72,66.39 arc(71.69,66.46) v1(71.42,66.63)
HDMI_TXCLK_P: length 46.6
  Top Layer w0.124: 69.6,65.81 71.04,65.81 arc(71.25,65.85) v1(71.42,65.96) ; JP2.88 107.34,52.38 arc(107.31,52.48) v2(107.25,52.57)
  Bottom Layer w0.124: v2(107.25,52.57) 107.32,52.64 arc(107.36,52.7) 107.37,52.76 107.37,54.76 arc(107.2,55.6) 106.72,56.32 99.6,63.45 ; 99.6,63.45 97.63,65.42 arc(96.91,65.9) 96.06,66.07 72.85,66.07 arc(72.72,66.01) 72.66,65.88 72.66,65.82 arc(72.48,65.63) 72.29,65.82 72.29,65.88 arc(72.24,66.01) 72.1,66.07 71.67,66.07 arc(71.53,66.04) v1(71.42,65.96)
HDMI_TXDDC_SCL_PORT: length 51.4
  Top Layer w0.124: 69.6,68.31 72.13,68.31 v3(72.13,68.31)
  Top Layer w0.152: JP2.100 109.74,52.15 109.87,52.28
  L2_INR1 w0.137: v2(109.87,52.29) 109.87,52.86 108.26,54.47 80.14,54.47 74.33,60.28 74.33,66.11 v3(72.13,68.31)
HDMI_TXDDC_SDA_PORT: length 56.7
  Top Layer w0.124: 69.6,68.81 v3(71.59,68.81)
  Top Layer w0.152: JP2.99 109.74,48.98 109.87,49.11 v2(109.87,49.12)
  L2_INR1 w0.137: v3(71.59,68.81) 71.82,69.03 73.07,69.03 75.11,67 75.11,60.55 80.47,55.18 108.69,55.18 110.7,53.18 110.7,49.95 v2(109.87,49.12)
HP_SNS: length 71.8
  Top Layer w0.158: JP3.8 114.47,34.02 128.03,20.47 132.29,20.47 134.85,17.91 R3.2 134.85,13.55 U9.1
HPL_OUT: length 84.9
  Top Layer w0.158: R2.2 130.38,12.6 U9.2 132.84,12.5 133.99,11.35 135.71,11.35 136.24,11.88 136.24,17.36 132.51,21.09 127.97,21.09 114.64,34.42 JP3.6
HPR_OUT: length 137.3
  Top Layer w0.158: v3(124.51,7.16) 126.51,5.16 U9.3 ; JP3.4 74.97,34.82 v2(75.17,35.02)
  Bottom Layer w0.158: 75.17,35.02 95.05,35.02 122.91,7.16 v3(124.51,7.16) ; v2(75.17,35.02) 74.53,35.02 73.96,35.58 73.96,36.38 74.78,37.2 103.46,37.2 122.94,56.68 v3(122.94,65.58)
MIC1_IN: length 111.8
  Top Layer w0.158: MIC_INPUT.1 61.61,22.77 65.64,26.8 65.64,33.22 68.32,35.9 72.46,35.9 73.21,35.16 73.21,33.9 73.48,33.62 JP3.10 114.28,33.62 126.79,21.11 126.79,12.19 U9.4
  Top Layer w0.3: 64.15,10.07 R4.1 62.76,18.38 60.6,20.54 60.6,22.27
MIPI_CSI_RX_D2N: length 3.7
  Top Layer w0.157: JP2.33 96.53,48.41 96.53,49.18 95.33,50.38 95.33,51.59 JP2.28
MIPI_CSI_RX_D2P: length 3.7
  Top Layer w0.157: JP2.35 96.94,49.49 95.74,50.69 JP2.30
MIPI_CSI_RX_D3N: length 3.7
  Top Layer w0.157: JP2.39 97.74,49.47 96.54,50.67 JP2.34
MIPI_CSI_RX_D3P: length 3.7
  Top Layer w0.157: JP2.41 98.14,49.88 96.94,51.08 JP2.36
NETLIGHT: length 110.1
  Top Layer w0.158: v4(66.35,110.98) 84.15,110.98 88.95,106.18 88.95,98.7 95.25,92.4 109.32,92.4 118.48,83.25 118.48,65.67 110.92,58.12 99.18,58.12 98.76,58.55 U2.51
PMIC_PWRON: length 3
  Top Layer w0.124: WAKE.1 109.74,11.48 JP1.99
SARADC_VIN1: length 49.1
  Top Layer w0.158: v2(103.73,18.24) 103.74,18.23 103.74,17.66
  Top Layer w0.3: 62.76,9.21 v3(62.73,9.24) R7.2 ; 61.37,9.24 59.9,9.22
  Bottom Layer w0.158: v2(103.73,18.24) 102.6,19.37 84.58,19.37 80.21,15 80.21,15 74.44,9.24 v3(62.73,9.24)
SPEAKER+: length 86.7
  Bottom Layer w0.158: v4(59.7,37.32) 61.53,39.16 102.08,39.16 119.24,56.31 119.24,71.6 v3(122.08,74.45)
SPEAKER-: length 93.5
  Top Layer w0.15: R11.1 125.73,73.85 125.13,74.45 v3(124.03,74.45)
  Bottom Layer w0.158: v4(59.7,32.75) 65.14,38.19 102.76,38.19 120.51,55.94 120.51,70.92 v3(124.03,74.45)
STATUS: length 118.2
  Top Layer w0.158: v4(66.35,114.59) 66.44,114.49 70.28,114.49 73.18,111.59 86.47,111.59 91.59,106.47 91.59,98.89 97.04,93.44 111.12,93.44 119.05,85.51 119.05,63.16 113.34,57.46 97.69,57.46 96.76,58.38 U2.49
USB2_HOST2_N: length 108.3
  Top Layer w0.106: v2(69.99,33.8) 70.17,33.62 71.53,33.62
  L2_INR1 w0.106: v4(72.08,132.46) 71.89,132.64 arc(71.69,132.78) 71.44,132.83 71.1,132.83 arc(70.25,132.66) 69.53,132.18 68.54,131.19 arc(68.05,130.46) 67.88,129.61 67.88,95.94 arc(67.69,94.97) 67.14,94.15 66.2,93.21 arc(65.72,92.49) 65.55,91.64 65.55,36.9 arc(65.72,36.04) 66.2,35.32 66.66,34.87 arc(66.79,34.81) 66.92,34.87 67.1,35.05 arc(67.37,35.05) 67.37,34.79 67.18,34.6 arc(67.13,34.47) 67.18,34.34 67.73,33.79 arc(67.95,33.64) 68.22,33.59 69.49,33.59 arc(69.76,33.65) v2(69.99,33.8)
USB2_HOST2_P: length 108.3
  Top Layer w0.106: JP3.11 70.14,33.22 v2(70,33.07)
  L2_INR1 w0.106: v4(72.08,133.45) 72.03,133.41 arc(71.74,133.21) 71.39,133.14 71.1,133.14 arc(70.13,132.95) 69.31,132.4 68.32,131.41 arc(67.77,130.58) 67.57,129.61 67.57,95.94 arc(67.4,95.09) 66.92,94.37 65.98,93.43 arc(65.43,92.61) 65.24,91.64 65.24,36.9 arc(65.43,35.93) 65.98,35.1 67.51,33.57 arc(67.84,33.36) 68.22,33.28 69.49,33.28 arc(69.76,33.23) v2(70,33.07)
USB2_HOST3_N: length 46.1
  Top Layer w0.106: JP3.3 72.19,34.82 arc(72.34,34.85) v2(72.47,34.93)
  L2_INR1 w0.106: v5(98.17,8.05) 98.17,8.35 arc(98.15,8.42) 98.11,8.48 98.11,8.49 arc(98.05,8.57) 98.03,8.66 98.03,11.04 arc(97.93,11.58) 97.62,12.04 97.17,12.49 arc(96.77,12.76) 96.29,12.85 88.55,12.85 arc(87.7,13.02) 86.97,13.51 85.74,14.74 arc(85.26,15.46) 85.09,16.31 85.09,23.27 arc(84.89,24.24) 84.34,25.06 75.39,34.02 arc(74.57,34.57) 73.59,34.76 72.88,34.76 arc(72.66,34.81) v2(72.47,34.93)
  Bottom Layer w0.106: v5(97.66,6.6) 97.66,7.07 arc(97.72,7.34) 97.87,7.58 98.04,7.75 arc(98.13,7.88) 98.16,8.03 98.17,8.04 v5(98.17,8.05)
USB2_HOST3_P: length 46.1
  Top Layer w0.106: JP3.5 72.13,34.42 arc(72.31,34.38) v2(72.47,34.28) ; v5(97.66,8.3) 97.66,7.93 arc(97.7,7.75) 97.8,7.6 97.94,7.46 arc(98.1,7.21) 98.16,6.92 USB1.B6
  L2_INR1 w0.106: v2(72.47,34.28) arc(72.66,34.41) 72.88,34.45 73.59,34.45 arc(74.45,34.28) 75.17,33.8 84.12,24.84 arc(84.61,24.12) 84.78,23.27 84.78,16.31 arc(84.97,15.34) 85.52,14.52 86.75,13.29 arc(87.58,12.74) 88.55,12.54 96.29,12.54 arc(96.65,12.47) 96.95,12.27 97.4,11.82 arc(97.64,11.46) 97.72,11.04 97.72,10.67 arc(97.67,10.54) 97.54,10.48 97.5,10.48 arc(97.31,10.3) 97.5,10.11 97.54,10.11 arc(97.67,10.06) 97.72,9.92 97.72,8.45 arc(97.71,8.37) v5(97.66,8.3)
USB3_HOST1_N: length 125.9
  Top Layer w0.106: v2(70.01,31.8) 70.19,31.62 JP3.19
  L2_INR1 w0.106: v4(96.76,89.95) 96.58,89.77 arc(96.47,89.6) 96.43,89.4 96.43,84.86 arc(96.6,84.01) 97.08,83.28 98.87,81.49 arc(99.59,81.01) 100.45,80.84 107.41,80.84 arc(108.38,80.65) 109.21,80.1 114.92,74.39 arc(115.47,73.56) 115.66,72.59 115.66,47.9 arc(115.47,46.93) 114.92,46.1 109.89,41.07 arc(109.06,40.52) 108.09,40.33 74.8,40.33 arc(73.95,40.16) 73.22,39.68 72.16,38.61 arc(71.72,37.96) 71.56,37.18 71.56,29.41 arc(71.39,28.53) 70.89,27.78 70.87,27.76 arc(70.25,27.35) 69.53,27.21 68.55,27.21 arc(68.02,27.31) 67.57,27.61 66.94,28.24 arc(66.73,28.55) 66.66,28.92 66.66,29.88 arc(66.75,30.33) 67,30.71 67.65,31.36 arc(67.91,31.53) 68.21,31.59 69.5,31.59 arc(69.77,31.64) v2(70.01,31.8)
USB3_HOST1_P: length 125.9
  Top Layer w0.106: v2(70.01,31.07) 70.16,31.22 JP3.21
  L2_INR1 w0.106: v4(95.76,89.95) 95.98,89.73 arc(96.08,89.58) 96.12,89.4 96.12,88.64 arc(96.06,88.51) 95.93,88.46 95.41,88.46 arc(95.23,88.27) 95.41,88.08 95.93,88.08 arc(96.06,88.03) 96.12,87.9 96.12,84.86 arc(96.31,83.89) 96.86,83.06 98.65,81.27 arc(99.47,80.72) 100.45,80.53 107.41,80.53 arc(108.26,80.36) 108.99,79.88 114.7,74.17 arc(115.18,73.44) 115.35,72.59 115.35,47.9 arc(115.18,47.05) 114.7,46.32 109.67,41.29 arc(108.95,40.81) 108.09,40.64 74.8,40.64 arc(73.83,40.45) 73,39.9 71.94,38.83 arc(71.43,38.07) 71.26,37.18 71.26,29.41 arc(71.1,28.65) 70.67,28 70.65,27.98 arc(70.14,27.64) 69.53,27.52 68.55,27.52 arc(68.14,27.6) 67.79,27.83 67.16,28.46 arc(67.02,28.67) 66.97,28.92 66.97,29.88 arc(67.03,30.21) 67.22,30.49 67.87,31.14 arc(68.02,31.24) 68.21,31.28 69.51,31.28 arc(69.78,31.23) v2(70.01,31.07)
USIM_CLK: length 18.4
  Bottom Layer w0.157: v4(72.53,92.67) 74.43,90.76 88.94,90.76 v4(89.76,89.95)
USIM_DATA: length 22.6
  Top Layer w0.157: U2.17 91.76,91.85 90.49,93.12 80.17,93.12 78.12,91.06 73.89,91.06 73.56,91.4 CARD1.C7
USIM_RST: length 20.9
  Top Layer w0.157: CARD1.C2 72.62,90.03 78.64,90.03 80.75,92.14 90.04,92.14 90.75,91.43 90.75,89.96 U2.18
USIM_VDD: length 18
  Top Layer w0.157: CARD1.C1 87.78,87.59 88.76,88.57 U2.20
V_USB: length 30.6
  Top Layer w0.127: v5(99.16,8.3) 99.16,6.6 ; 96.66,6.6 v5(96.66,8.3)
  Top Layer w0.158: v4(111.03,4) 111.03,5.24 112.79,7 D1.2
  Bottom Layer w0.157: v4(111.03,4) 109.38,5.65 98.92,5.65 98.19,6.37 98.19,6.95 99.16,7.92 99.16,8.27 99.17,8.53 99.64,9.01 99.64,9.49 99.3,9.83 98.52,9.83 96.97,8.27 96.63,8.27 96.58,8.32
$2N2: length 169.9
  L2_INR1 w0.137: v4(72.08,127.06) v4(72.08,131.45)
  L2_INR1 w0.138: v4(72.08,127.06) 86.11,113.03 112,113.03 128.56,96.47 128.56,8.54 124.04,4.02 v4(122,4.02)
$2N7: length 2.6
  Top Layer w0.15: U1.3 U1.2 C3.2
$2N10: length 5.8
  Top Layer w0.15: 124.03,69.1 124.55,69.1 125.73,70.28 R11.2 ; U1.4 R10.2
$2N12: length 3.8
  Top Layer w0.3: R8.1 R9.2 C1.2
$2N528: length 1.6
  Top Layer w0.15: R10.1 C2.2
$2N1557: length 4.6
  Top Layer w0.299: Mic_switch.2 67.15,5.19 66.03,6.31 R8.2
$3N1: length 166.6
  Top Layer w0.158: RF2.1 77.65,6.2 77.13,5.68 76.23,5.68 75.41,6.5 75.41,9.35 77.67,11.61 103.94,11.61 105.83,9.73 120.47,9.73 129.43,0.77 136.94,0.77 137.67,1.5 137.67,16.92 117.9,36.68 95.57,36.68 87.73,44.52 87.73,60.02 U2.82
$3N2: length 116.5
  L2_INR1 w0.138: v4(113.22,83.49) 116.75,79.96 116.75,24.59 113.63,21.48 113.63,12.58 102.83,1.77 92.39,1.77 90.14,4.02 v3(76.18,4.02)
$3N283: length 2.2
  Top Layer w0.5: R15.2 LED_SIM_STATUS.1
$3N284: length 2.3
  Top Layer w0.5: R16.2 64.3,110.93 LED_SIM_DATA.1
$3N841: length 3.5
  Top Layer w0.282: 80.68,6.85 80.66,6.83 80.66,6.1 79.16,4.6 79.16,4.04 GPS_Switch.2
$3N4722: length 3.4
  Top Layer w0.124: 116.59,73.48 113.23,73.48 U2.69
$4N10: length 9.1
  Top Layer w0.5: 75.3,104.85 75.3,105.57 75.84,106.11 R18.2 80.63,106.2 80.63,108.99
$4N12: length 3
  Top Layer w0.5: 97.62,100.24 98.19,100.24 99.46,101.52 100.1,101.52
$4N15: length 2.3
  Top Layer w0.5: U3.7 108.22,101.51
$4N20: length 7.5
  Top Layer w0.5: U3.5 105.92,98.48 106.97,97.43 R12.1 R13.1
$4N24: length 15.5
  Bottom Layer w0.157: v5(98.66,6.6) 100.21,8.15 100.21,10.36 99.81,10.76 92.02,10.76 v4(90.07,8.81)
$4N26: length 9
  Top Layer w0.127: 97.16,8.3 97.16,7.67
  Bottom Layer w0.157: v5(97.16,7.67) 97.16,6.97 95.7,5.51 v4(90.11,5.51)
$4N691: length 2.5
  Top Layer w0.5: R5.2 95.46,104.37 95.05,104.79 C6.2
$4N692: length 2.1
  Top Layer w0.5: R6.1 114.41,102.73
$4N693: length 118.4
  L2_INR1 w0.138: v4(90.26,2.18) 91.55,0.89 103.47,0.89 114.54,11.97 114.54,20.54 117.5,23.5 117.5,91.87 111.95,97.42 v4(111.95,97.43)
$4N694: length 53
  Top Layer w0.15: R13.2 113.05,95.37 119.71,88.71 119.71,66.21 122.86,63.06 130.83,63.06 135.95,68.18 135.95,68.48

## Copper pours and planes (outline as drawn; the poured copper is in the pictures)
+5V on Top Layer: 117.2,6.79 120.08,6.79 120.08,3.52 117.2,3.52
+5V on Top Layer: 75,94.66 73.98,95.68 73.98,100.02 74.36,100.4 78.25,100.4 79.69,98.95 79.69,97.05 77.31,94.66
+5V on L2_INR1: 73.85,71.36 77.69,71.36 78.31,71.98 78.31,94.92 82.19,98.79 82.19,100.71 87.02,105.54 100.71,105.54 102.13,106.97 102.13,108.81 100.63,110.31 82.65,110.31 73.85,101.52
GND on L3_GND: 67.96,72.94 69.72,72.94 69.72,70.92 67.96,70.92
GND on L3_GND: 57.93,137.84 138.62,137.84 138.62,0.16 57.93,0.16
GND on L3_GND: 60.87,59.06 62.14,59.06 62.14,58.06 60.87,58.06
GND on L3_GND: 62.25,60.44 63.51,60.44 63.51,58.93 62.25,58.93
GND on L3_GND: 67.96,75.2 69.72,75.2 69.72,73.18 67.96,73.18
GND on L3_GND: 60.87,73.56 62.14,73.56 62.14,72.56 60.87,72.56
GND on L3_GND: 93.31,4.6 94.77,4.6 94.77,3.39 93.31,3.39
GND on L3_GND: 63.62,73.56 64.89,73.56 64.89,72.56 63.62,72.56
GND on L3_GND: 62.25,74.94 63.51,74.94 63.51,73.43 62.25,73.43
GND on L3_GND: 67.96,58.44 69.72,58.44 69.72,56.42 67.96,56.42
GND on L3_GND: 62.25,58.19 63.51,58.19 63.51,56.68 62.25,56.68
GND on L3_GND: 101.06,4.6 102.51,4.6 102.51,3.39 101.06,3.39
GND on L3_GND: 70.08,73.56 71.35,73.56 71.35,72.56 70.08,72.56
GND on L3_GND: 70.08,59.06 71.35,59.06 71.35,58.06 70.08,58.06
GND on L3_GND: 102.31,4.6 103.77,4.6 103.77,3.39 102.31,3.39
GND on L3_GND: 66.33,73.56 67.6,73.56 67.6,72.56 66.33,72.56
GND on L3_GND: 66.33,59.06 67.6,59.06 67.6,58.06 66.33,58.06
GND on L3_GND: 92.06,4.6 93.51,4.6 93.51,3.39 92.06,3.39
GND on L3_GND: 63.62,59.06 64.89,59.06 64.89,58.06 63.62,58.06
GND on L3_GND: 62.25,72.69 63.51,72.69 63.51,71.18 62.25,71.18
GND on L3_GND: 67.96,60.7 69.72,60.7 69.72,58.68 67.96,58.68
VBAT on L2_INR1: 86.96,100.71 88.58,99.1 88.58,72.78 91.65,69.71 111.09,69.52 113.65,67.3 113.69,65.41 112.88,64.59 85.19,64.59 81.74,68.05 81.74,72.47 83.97,74.7 83.97,99.59 85.09,100.71
VCC_3V3 on Bottom Layer: 67.92,4.8 67.92,3.84 68.3,3.46 69.18,3.46 71.51,5.79 82.97,5.79 93.4,15.12 106.18,15.12 107.76,16.83 107.76,18.84 107.1,19.5 106.08,19.5 105.49,18.91 105.49,17.78 104.73,17.03 89.48,17.03 80.44,7.98 71.1,7.98

Small or netless copper shapes (teardrops, artwork), in the pictures only: 17 on L3_GND

## Text on the board
Top Silkscreen Layer: OFF | ON | USB | CHARGE | Thank you ER,CZ,FP,PC,PM,BP,BS,AF,AR | USB_WEBCAM | + | - | Orange Pi CM4 | Screen Size | 8.1cm OR 81mm | 13.8cm Or 138mm | OURphone v1.1 | motherboard - receiving part
